# EAGLE design WW-12 (EAGLE 6.5.0)
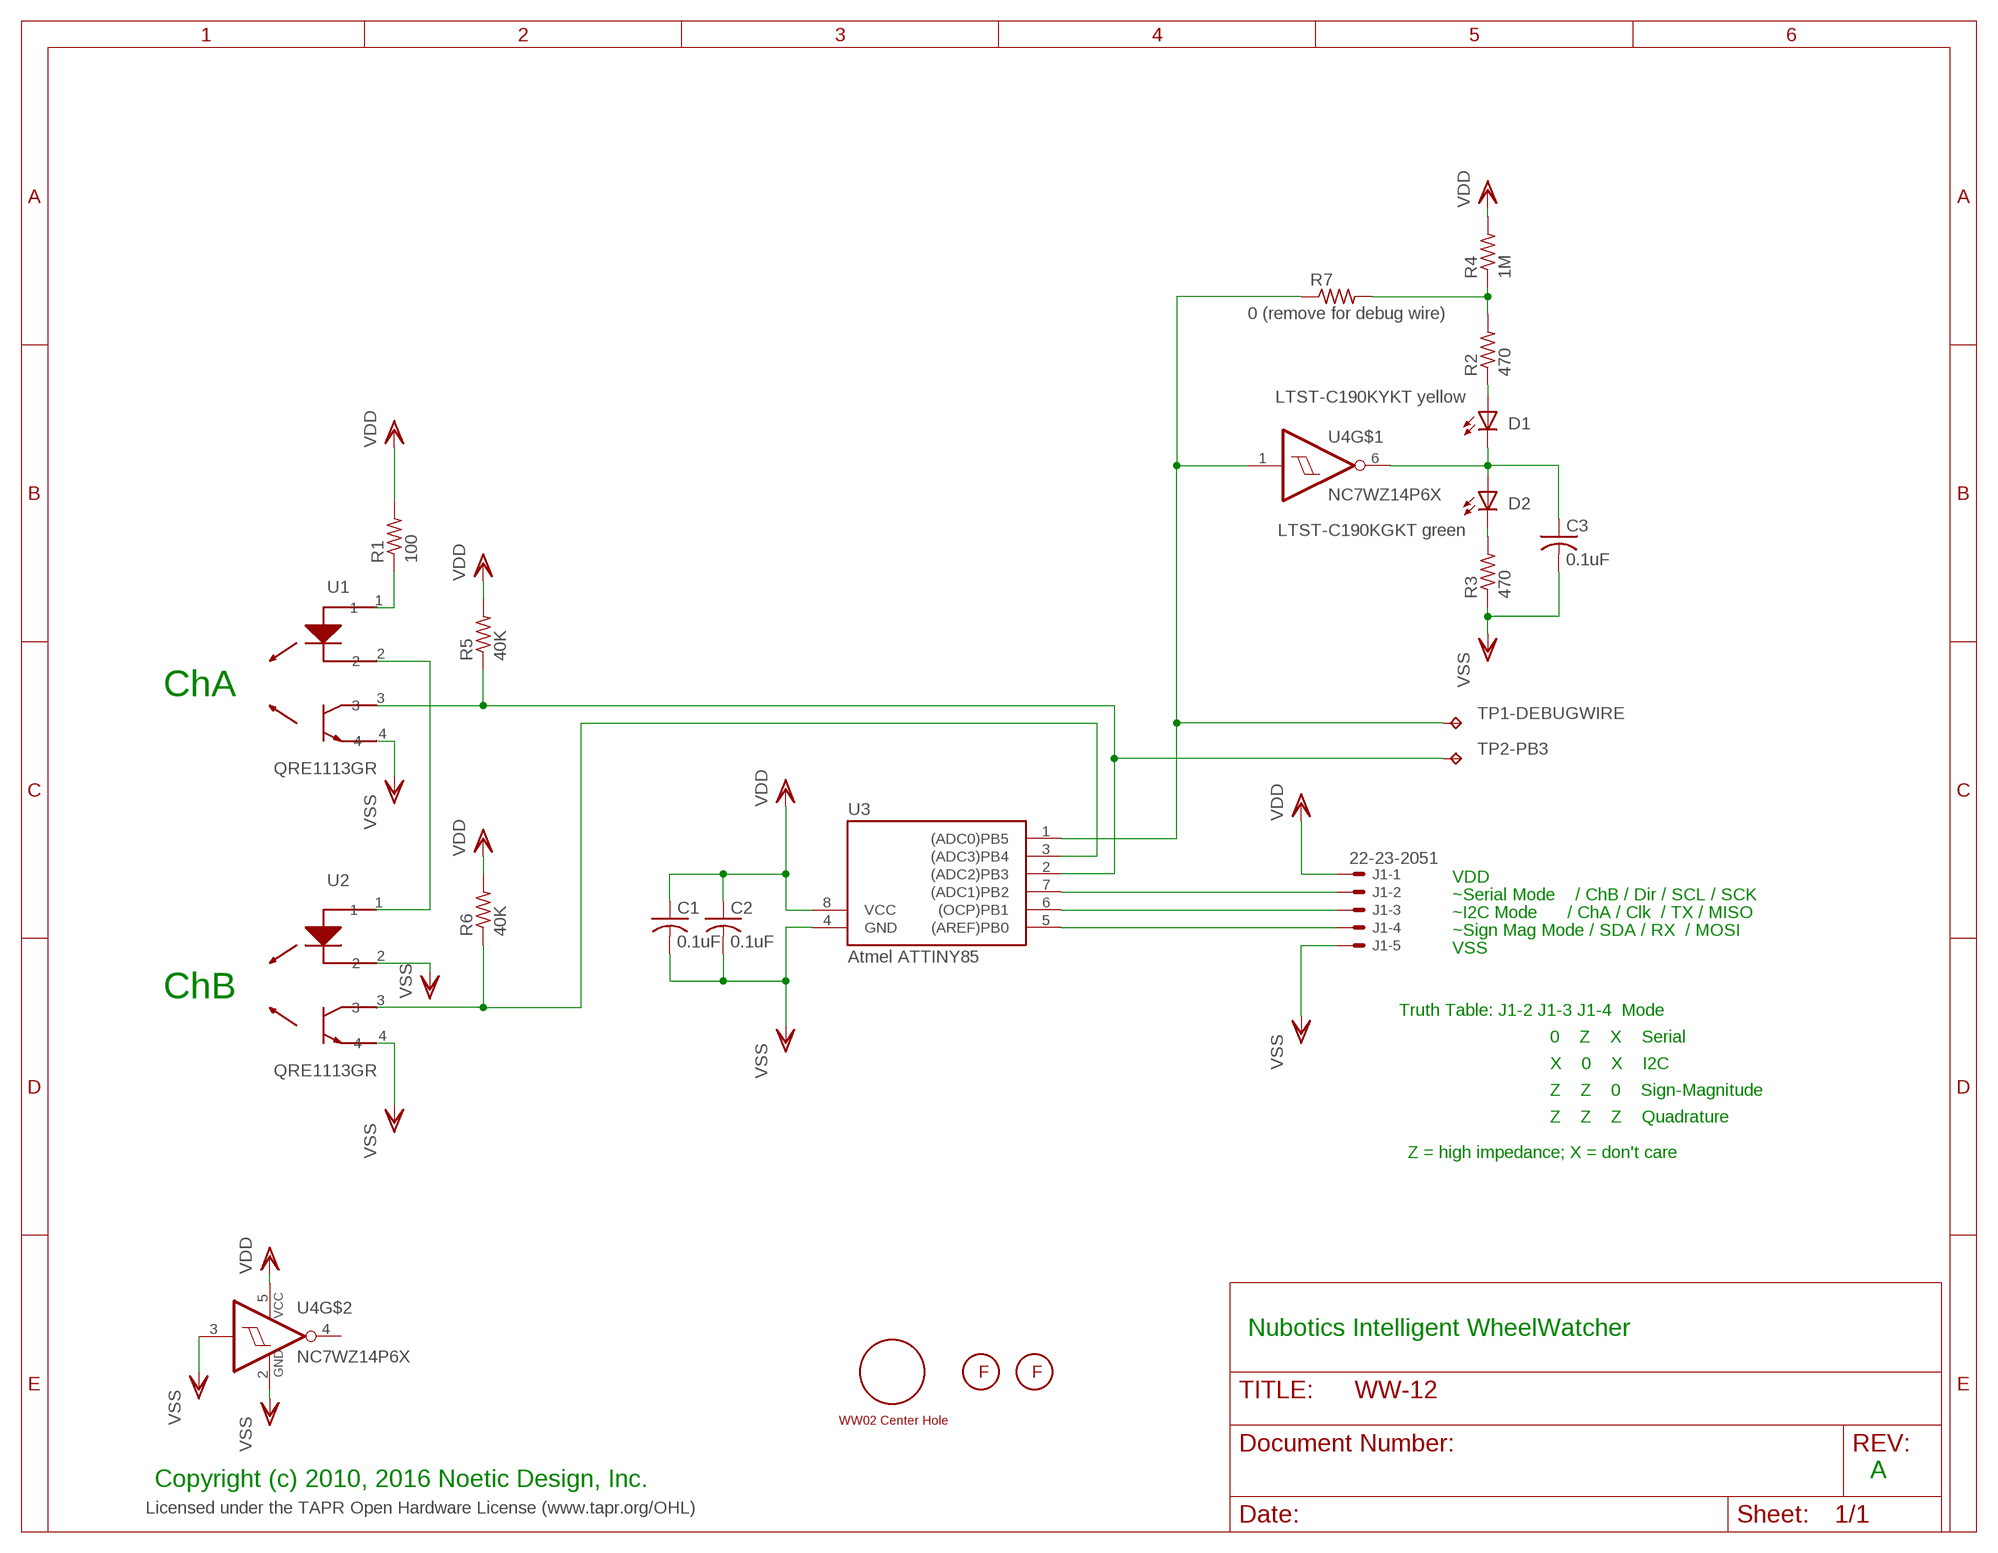
[diagram p0: schematic, sheet 1]

## Parts
C1  0.1uF  C-USC0603  [C0603]
C2  0.1uF  C-USC0603  [C0603]
C3  0.1uF  C-USC0603  [C0603]
D1  LTST-C190KYKT yellow  LEDCHIP-LED0603  [CHIP-LED0603]
D2  LTST-C190KGKT green  LEDCHIP-LED0603  [CHIP-LED0603]
FM1  FIDUCIAL2MMCIRCLE  [FIDUCIAL_2MMCIRCLE]
FM2  FIDUCIAL2MMCIRCLE  [FIDUCIAL_2MMCIRCLE]
J1  22-23-2051  [22-23-2051]
R1  100  R-US_R0603  [R0603]
R2  470  R-US_R0603  [R0603]
R3  470  R-US_R0603  [R0603]
R4  1M  R-US_R0603  [R0603]
R5  40K  R-US_R0603  [R0603]
R6  40K  R-US_R0603  [R0603]
R7  0 (remove for debug wire)  R-US_R0603  [R0603]
TP1-DEBUGWIRE  DEBUG WIRE  TPB1,27  [B1,27]
TP2-PB3  DEBUG WIRE  TPB1,27  [B1,27]
U1  QRE1113GR  [4TSOP]
U2  QRE1113GR  [4TSOP]
U3  Atmel ATTINY85  TINY85S  [SOIC8]
U4  NC7WZ14P6X  [SOT65P210X110-6AN_SC88_SC70-6]
U$1  WW02-CENTER  [WW02-CENTER]

## Nets
N$1: U1.2 U2.1
N$2: R1.1 U1.1
N$3: R5.1 TP2-PB3.TP U1.3 U3.2((ADC2)PB3)
N$4: R6.1 U2.3 U3.3((ADC3)PB4)
N$5: D1.A R2.1
N$6: C3.1 D1.C D2.A U4.6(O)
N$7: D2.C R3.2
N$9: R2.2 R4.1 R7.2
N$10: J1.2 U3.7((ADC1)PB2)
N$11: R7.1 TP1-DEBUGWIRE.TP U3.1((ADC0)PB5) U4.1(I)
N$12: J1.3 U3.6((OCP)PB1)
N$13: J1.4 U3.5((AREF)PB0)
VDD: C1.1 C2.1 J1.1 R1.2 R4.2 R5.2 R6.2 U3.8(VCC) U4.5(VCC)
VSS: C1.2 C2.2 C3.2 J1.5 R3.1 U1.4 U2.2 U2.4 U3.4(GND) U4.2(GND) U4.3(I)
Unconnected: U4.4(O)

## Notes on the sheet
- ChA
- VDD
- ~Serial Mode    / ChB / Dir / SCL / SCK
- ~I2C Mode      / ChA / Clk  / TX / MISO
- ~Sign Mag Mode / SDA / RX  / MOSI
- VSS
- ChB
- Truth Table: J1-2 J1-3 J1-4  Mode
- 0    Z    X    Serial
- X    0    X    I2C
- Z    Z    0    Sign-Magnitude
- Z    Z    Z    Quadrature
- Z = high impedance; X = don't care
- Nubotics Intelligent WheelWatcher
- A
- Copyright (c) 2010, 2016 Noetic Design, Inc.
- Licensed under the TAPR Open Hardware License (www.tapr.org/OHL)

## Library data of the parts
C1 C2 = resistor:C-US: CAPACITOR, American symbol
C3 = rcl:C-US: CAPACITOR, American symbol
D1 D2 = led:LED: LED OSRAM: - CHIPLED LG R971, LG N971, LY N971, LG Q971, LY Q971, LO R971, LY R971 LH N974, LH R974 LS Q976, LO Q976, LY Q976 LO Q996 - Hyper CHIPLED LW Q18S LB Q993, LB Q99A, LB R99A - SideLED LS A670, LO A670, LY A670, LG A670, LP A670 LB A673, LV A673, LT A673, LW A673 LH A674 LY A675 LS A676, LA A676, LO A676, LY A676, LW A676 LS A679, LY A679, LG A679 - Hyper Micro SIDELED® LS Y876, LA Y876, LO Y876, LY Y876 LT Y87S - SmartLED LW L88C, LW L88S LB L89C, LB L89S, LG L890 LS L89K, LO L89K, LY L89K LS L896, LA L896, LO L896, LY L896 - TOPLED LS T670, LO T670, LY T670, LG T670, LP T670 LSG T670, LSP T670, LSY T670, LOP T670, LYG T670 LG T671, LOG T671, LSG T671 LB T673, LV T673, LT T673, LW T673 LH T674 LS T676, LA T676, LO T676, LY T676, LB T676, LH T676, LSB T676, LW T676 LB T67C, LV T67C, LT T67C, LS T67K, LO T67K, LY T67K, LW E67C LS E67B, LA E67B, LO E67B, LY E67B, LB E67C, LV E67C, LT E67C LW T67C LS T679, LY T679, LG T679 LS T770, LO T770, LY T770, LG T770, LP T770 LB T773, LV T773, LT T773, LW T773 LH T774 LS E675, LA E675, LY E675, LS T675 LS T776, LA T776, LO T776, LY T776, LB T776 LHGB T686 LT T68C, LB T68C - Hyper Mini TOPLED® LB M676 - Mini TOPLED Santana® LG M470 LS M47K, LO M47K, LY M47K Source: http://www.osram.convergy.de LUXEON: - LUMILED® LXK2-PW12-R00, LXK2-PW12-S00, LXK2-PW14-U00, LXK2-PW14-V00 LXK2-PM12-R00, LXK2-PM12-S00, LXK2-PM14-U00 LXK2-PE12-Q00, LXK2-PE12-R00, LXK2-PE12-S00, LXK2-PE14-T00, LXK2-PE14-U00 LXK2-PB12-K00, LXK2-PB12-L00, LXK2-PB12-M00, LXK2-PB14-N00, LXK2-PB14-P00, LXK2-PB14-Q00 LXK2-PR12-L00, LXK2-PR12-M00, LXK2-PR14-Q00, LXK2-PR14-R00 LXK2-PD12-Q00, LXK2-PD12-R00, LXK2-PD12-S00 LXK2-PH12-R00, LXK2-PH12-S00 LXK2-PL12-P00, LXK2-PL12-Q00, LXK2-PL12-R00 Source: www.luxeon.com KINGBRIGHT: KA-3528ASYC Source: www.kingbright.com
FM1 FM2 = pickplace:FIDUCIAL: Fiducial marks
J1 = con-molex:22-23-2051: .100" (2.54mm) Center Header - 5 Pin
R1-R3 R5 R6 = resistor:R-US_: RESISTOR, American symbol
R4 R7 = rcl:R-US_: RESISTOR, American symbol
TP1-DEBUGWIRE TP2-PB3 = testpad:TP: Test pad
U1 U2 = noetic:QRE1113GR: Fairchild Semiconductor QRE1113GR SMT Reflective Object Sensor Gull wing SMT
U3 = atmel:TINY85: MICROCONTROLLER 2.7-5.5 V 8 Kbytes FLASH 512 bytes EEPROM 512 bytes RAM 4-channel 10 bit ADC
U4 = fairchild-tinylogic:NC7W*14
U$1 = noetic:WW02-CENTER: WW-02/WW-12 center hole

## Net classes
0 default: width 0.203 mm, drill 0.203 mm, clearance 0.229 mm
1 power: width 0.61 mm, drill 0.61 mm, clearance 0.254 mm

## Board
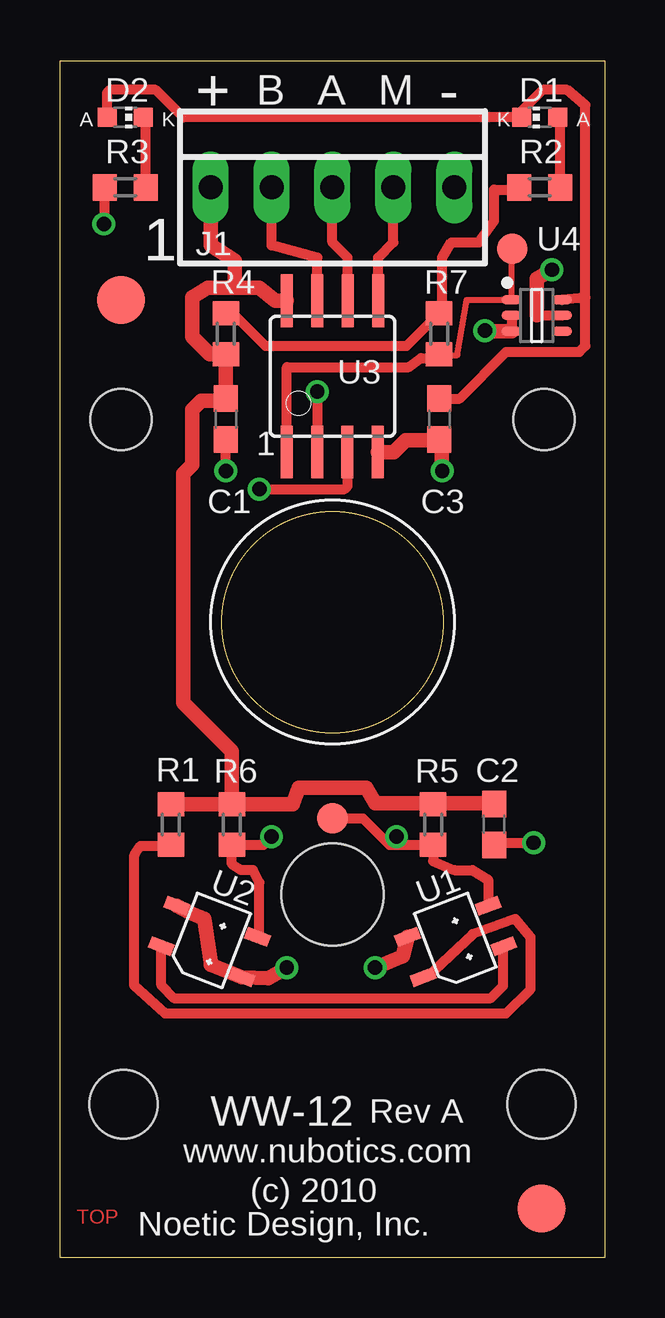
[diagram p1: board, top side]
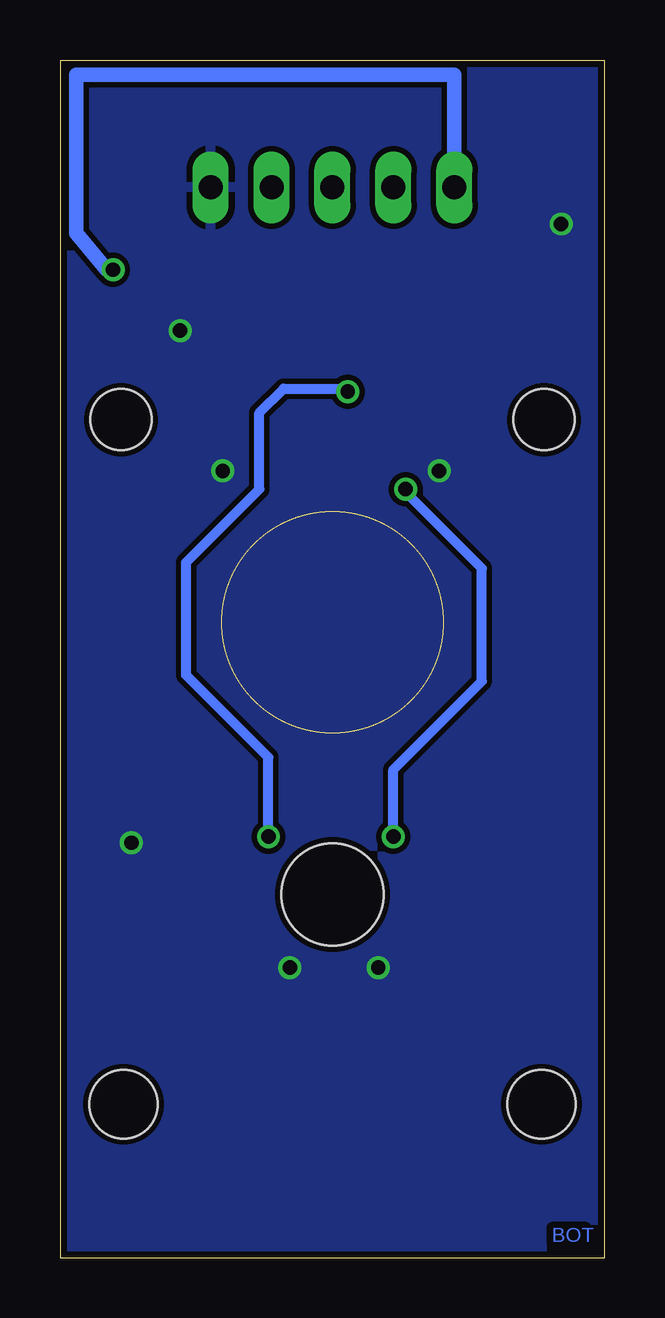
[diagram p2: board, bottom side, seen from below]

Size 22.71 x 49.89 mm. Coordinates in mm from the lower left corner, seen from the top.
Outline: 0,49.89 22.71,49.89 22.71,0 0,0 0,49.89
Copper layers (1*16): Top 0.035mm / dielectric 0.65mm / Bottom 0.035mm
Design rules "advCircuits7_2lyr_2": minimum track width 7mil, minimum drill 15mil, track to track 8mil, track to pad 8mil, pad to pad 8mil, via to via 8mil, smd to smd 8mil, copper to edge 10mil, drill to drill 8mil, minimum pad ring 10mil, minimum via ring 7mil, stop-mask expansion 2.5mil, vias tented up to drill 0mil, thermal gap 10mil
Holes 2.54 mm at 2.54,34.92 20.17,34.92
Holes 2.84 mm at 2.64,6.4 20.07,6.4
Holes 4.27 mm at 11.35,15.14
tRestrict: area 0,32.4 to 5.1,37.5; area 17.6,32.4 to 22.7,37.5

### Footprints (pad centres in the part's own frame; a part is rotated, then mirrored left to right if it is on the bottom)
C0603 = smd 1.1 x 1: 1 -0.85,0; 2 0.85,0
CHIP-LED0603 = smd 0.8 x 0.8: A 0,-0.75; C 0,0.75
FIDUCIAL_2MMCIRCLE = smd 2 x 2: P$1 0,0
22-23-2051 = drill 1 long: 1 -5.08,0; 2 -2.54,0; 3 0,0; 4 2.54,0; 5 5.08,0
R0603 = smd 1 x 1.1: 1 -0.85,0; 2 0.85,0
B1,27 = smd 1.27 x 1.27: TP 0,0
4TSOP = smd 1.016 x 0.508: 1 -1.8,-0.9; 2 1.8,-0.9; 3 1.8,0.9; 4 -1.8,0.9
SOIC8 = smd 0.5 x 2.2: 1 -1.905,-3.154; 2 -0.645,-3.154; 3 0.625,-3.154; 4 1.895,-3.154; 5 1.905,3.154; 6 0.635,3.154; 7 -0.635,3.154; 8 -1.905,3.154
SOT65P210X110-6AN_SC88_SC70-6 = smd 0.85 x 0.4: 1 -1.05,0.65; 2 -1.05,0; 3 -1.05,-0.65; 4 1.05,-0.65; 5 1.05,0; 6 1.05,0.65

### Placement (x,y rotation side)
C1  6.91,34.95 270 top
C2  18.08,18.06 270 top
C3  15.8,34.95 270 top
D1  19.99,47.52 90 top
D2  2.72,47.52 270 top
FM1  20.07,2.06 0 top
FM2  2.54,39.9 0 top
J1  11.35,44.6 0 top
R1  4.62,18.06 90 top
R2  19.99,44.6 180 top
R3  2.72,44.6 0 top
R4  6.91,38.51 270 top
R5  15.54,18.06 90 top
R6  7.16,18.06 90 top
R7  15.8,38.51 90 top
TP1-DEBUGWIRE  18.85,42.04 180 top
TP2-PB3  11.35,18.31 0 top
U1  16.48,13.18 21.1 top
U2  6.22,13.18 338.9 top
U3  11.35,36.73 0 top
U4  19.86,39.27 0 top
U$1  11.35,26.49 0 top

### Tracks (layer width: path | path; a pad name or v marks a point on that pad's centre or on a via)
N$1
  Top 0.406: U2.1 4.22,11.35 4.75,10.82 17.96,10.82 18.47,11.33 18.47,12.97 U1.2
N$2
  Top 0.406: U1.1 15.28,11.7 17.2,13.49 18.97,14.12 19.61,13.36 19.61,11.2 18.59,10.19 4.37,10.19 3.1,11.33 3.1,16.79 3.35,17.17 4.58,17.17 R1.1
N$3  (via drill 0.6)
  Top 0.406: U1.3 17.84,15.76 17.2,16.15 16.43,16.15 15.54,16.54 R5.1 14.36,17.21 | 14.36,17.21 v14.02,17.55 | v10.72,36.09 10.72,33.58 U3.2 | 14.36,17.21 13.73,17.21 12.62,18.31 TP2-PB3.TP
  Bottom 0.406: v14.02,17.55 14.02,20.85 17.45,24.28 17.45,28.98 14.4,32.03 14.4,35.2 13.39,36.22 10.85,36.22 v10.72,36.09
N$4  (via drill 0.6)
  Top 0.406: U2.3 8.31,13.45 8.31,15.65 8.05,16.15 7.54,16.15 7.16,16.41 R6.1 8.47,17.21 v8.81,17.55 | v8.31,32.03 11.86,32.03 11.99,32.16 U3.3
  Bottom 0.406: v8.81,17.55 8.81,20.35 5.13,24.03 5.13,28.73 8.31,31.9 v8.31,32.03
N$5
  Top 0.406: R2.1 20.84,47.42 D1.A
N$6
  Top 0.406: D2.A 1.96,47.54 1.96,48.54 2.08,48.67 3.99,48.67 5.13,47.52 D1.C 19.24,47.79 20.12,48.67 21.13,48.67 21.89,48.03 21.89,40.01 | 21.89,40.01 U4.6 | C3.1 16.65,35.8 18.59,37.74 21.64,37.74 21.89,38 21.89,40.01
N$7
  Top 0.406: R3.2 3.57,47.42 D2.C
N$9
  Top 0.406: R2.2 19.14,44.51 18.08,44.51 18.08,43.21 17.45,42.32 16.31,42.32 15.93,41.68 15.93,39.48 R7.2 14.44,38 8.56,38 7.2,39.36 R4.1
N$10
  Top 0.406: U3.7 10.72,41.68 8.81,42.19 J1.2
N$11
  Top 0.254: 18.81,42.07 U4.1 16.96,39.92 16.94,39.9 16.56,37.62 15.84,37.62
  Top 0.406: U3.1 9.45,37.11 14.53,37.11 15.04,37.49 15.63,37.49 R7.1 15.84,37.62 | 18.81,42.07 TP1-DEBUGWIRE.TP
N$12
  Top 0.406: U3.6 11.99,41.68 11.35,42.32 J1.3
N$13
  Top 0.406: U3.5 13.26,41.68 13.89,42.32 J1.4
VDD  (via drill 0.6)
  Top 0.406: 18.05,18.99 C2.1 18.05,18.95 | 15.54,18.95 15.63,18.82 R5.2 15.29,18.91 15.29,18.95 | 6.82,35.71 C1.1 | 19.86,39.27 U4.5
  Top 0.61: U3.8 8.96,39.88 8.31,40.41 7.29,40.41 | R1.2 R6.2 | R6.2 9.7,18.91 9.96,19.58 12.75,19.58 13.13,18.95 15.29,18.95 | 15.54,18.95 18.05,18.95 | R6.2 7.16,21.11 5.13,23.14 5.13,32.66 5.51,33.05 5.51,35.33 5.89,35.71 6.82,35.71 | C1.1 R4.2 6.23,37.66 5.51,38.38 5.51,40.03 6.15,40.41 7.29,40.41 | 7.29,40.41 7.29,41.55 6.27,42.19 J1.1 | 19.86,39.27 19.86,40.79 v20.5,41.17
  Bottom 0.406: 20.75,41.17 v20.5,41.17
  Bottom 0.61: 20.75,41.17 22.02,42.7 22.02,49.3 6.27,49.3 J1.1
VSS  (via drill 0.6)
  Top 0.406: U1.4 14.59,13.49 | C2.2 18,17.3 v19.74,17.3 | 15.76,34.06 C3.2 15.89,33.97 | R3.1 1.87,43.12 v1.83,43.08 | v6.91,32.79 C1.2 | U4.2 U4.3
  Top 0.61: U2.4 5.42,14.38 6.02,14.12 6.27,12.34 6.29,12.2 U2.2 8.69,11.66 v9.45,12.09 | U1.4 14.27,12.56 v13.13,12.09 | U3.4 13.91,33.57 14.4,34.06 15.76,34.06 | 15.89,33.97 v15.93,32.79 | U4.3 18.1,38.62 v17.7,38.63
  pour Bottom: 22.4,0.28 22.4,49.56 0.3,49.56 0.3,0.28

### Text on the board
Top: TOP
Bottom: BOT
tPlace: A | K | K | A | 1 | 1 | WW-12 | Rev A | www.nubotics.com | (c) 2010 | Noetic Design, Inc.
tNames: + | B | A | M | -
Document: Licensed under the TAPR Open Hardware License (www.tapr.org/OHL)